# Altium schematic sheet 07_8MPLUS_PHY.SchDoc: 8MPLUS_PHY
size 420 x 297 mm; Author: Lukas Henkel; DocumentNumber: 7; SheetNumber: 7; SheetTotal: 16; DocSize: A3
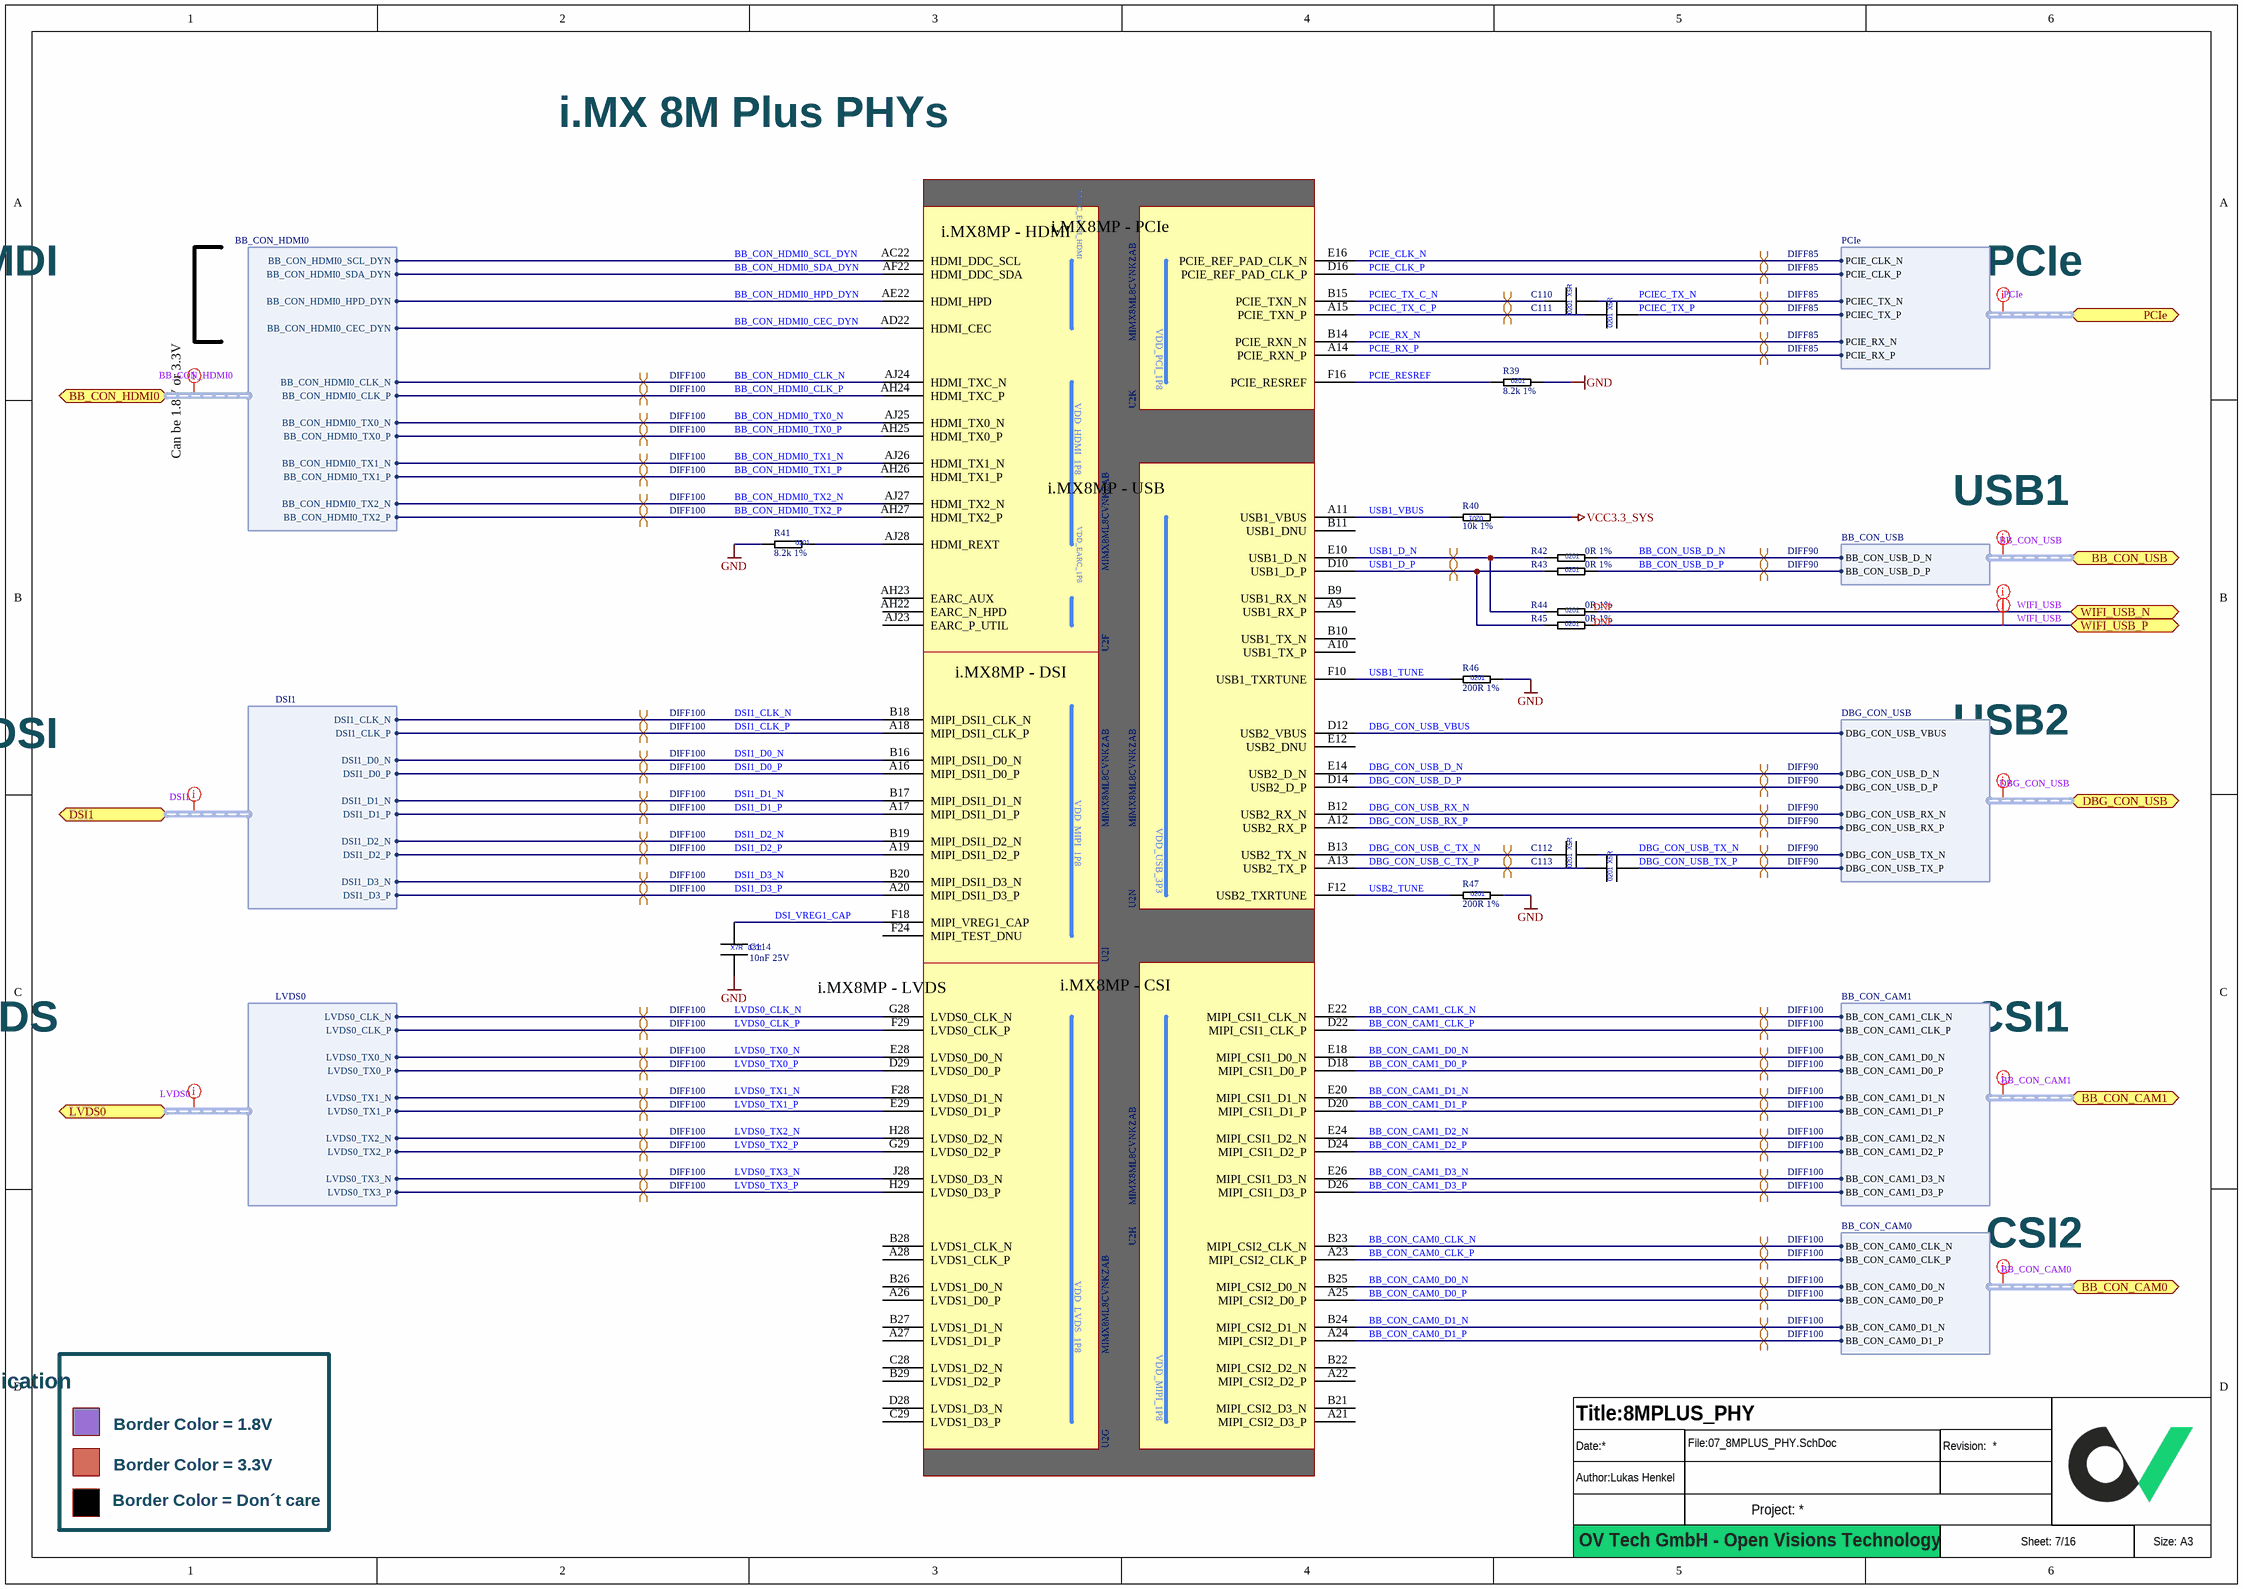
[diagram p0: 07_8MPLUS_PHY.SchDoc]

## Parts
?  (no value)  (graphical)
C110  100nF 10V  [CAPC0603X03L]  (value not drawn)
C111  100nF 10V  [CAPC0603X03L]  (value not drawn)
C112  100nF 10V  [CAPC0603X03L]  (value not drawn)
C113  100nF 10V  [CAPC0603X03L]  (value not drawn)
C114  10nF 25V  [CAPC0603X03L]
R39  8.2k 1%  [RESC0603X03L]
R40  10k 1%  [RESC0603X03L]
R41  8.2k 1%  [RESC0603X03L]
R42  0R 1%  [RESC0603X03L]
R43  0R 1%  [RESC0603X03L]
R44  0R 1%  [RESC0603X03L]
R45  0R 1%  [RESC0603X03L]
R46  200R 1%  [RESC0603X03L]
R47  200R 1%  [RESC0603X03L]
U2  MIMX8ML8CVNKZAB  [BGA548C50P29X29_1500X1500X148]  (parts F,G,H,I,K,N of 15)

## Ports
BB_CON_CAM0 (bidir, harness BB_CON_CAM0), BB_CON_CAM1 (bidir, harness BB_CON_CAM1), BB_CON_HDMI0 (bidir, harness BB_CON_HDMI0), BB_CON_USB (bidir, harness BB_CON_USB), DBG_CON_USB (bidir, harness DBG_CON_USB), DSI1 (bidir, harness DSI1), LVDS0 (bidir, harness LVDS0), PCIe (bidir, harness PCIe), WIFI_USB_N (bidir), WIFI_USB_P (bidir)

## Harnesses
BB_CON_HDMI0: BB_CON_HDMI0_SCL_DYN, BB_CON_HDMI0_SDA_DYN, BB_CON_HDMI0_HPD_DYN, BB_CON_HDMI0_CEC_DYN, BB_CON_HDMI0_CLK_N, BB_CON_HDMI0_CLK_P, BB_CON_HDMI0_TX0_N, BB_CON_HDMI0_TX0_P, BB_CON_HDMI0_TX1_N, BB_CON_HDMI0_TX1_P, BB_CON_HDMI0_TX2_N, BB_CON_HDMI0_TX2_P
BB_CON_USB: BB_CON_USB_D_N, BB_CON_USB_D_P
PCIe: PCIE_CLK_N, PCIE_CLK_P, PCIEC_TX_N, PCIE_RX_P, PCIE_RX_N, PCIEC_TX_P
BB_CON_CAM1: BB_CON_CAM1_D0_N, BB_CON_CAM1_D0_P, BB_CON_CAM1_D1_N, BB_CON_CAM1_D1_P, BB_CON_CAM1_CLK_N, BB_CON_CAM1_CLK_P, BB_CON_CAM1_D2_N, BB_CON_CAM1_D2_P, BB_CON_CAM1_D3_N, BB_CON_CAM1_D3_P
BB_CON_CAM0: BB_CON_CAM0_D0_N, BB_CON_CAM0_D0_P, BB_CON_CAM0_D1_N, BB_CON_CAM0_D1_P, BB_CON_CAM0_CLK_N, BB_CON_CAM0_CLK_P
DSI1: DSI1_CLK_N, DSI1_CLK_P, DSI1_D0_N, DSI1_D0_P, DSI1_D1_N, DSI1_D1_P, DSI1_D2_N, DSI1_D2_P, DSI1_D3_N, DSI1_D3_P
LVDS0: LVDS0_CLK_N, LVDS0_CLK_P, LVDS0_TX0_N, LVDS0_TX0_P, LVDS0_TX1_N, LVDS0_TX1_P, LVDS0_TX2_N, LVDS0_TX2_P, LVDS0_TX3_N, LVDS0_TX3_P
DBG_CON_USB: DBG_CON_USB_VBUS, DBG_CON_USB_D_N, DBG_CON_USB_D_P, DBG_CON_USB_RX_N, DBG_CON_USB_RX_P, DBG_CON_USB_TX_N, DBG_CON_USB_TX_P

## Nets
GND: C114.2 R39.2 R41.2 R46.2 R47.2
VCC3.3_SYS: R40.1
BB_CON_CAM0_CLK_N: U2.B23(MIPI_CSI2_CLK_N) ; port BB_CON_CAM0.BB_CON_CAM0_CLK_N
BB_CON_CAM0_CLK_P: U2.A23(MIPI_CSI2_CLK_P) ; port BB_CON_CAM0.BB_CON_CAM0_CLK_P
BB_CON_CAM0_D0_N: U2.B25(MIPI_CSI2_D0_N) ; port BB_CON_CAM0.BB_CON_CAM0_D0_N
BB_CON_CAM0_D0_P: U2.A25(MIPI_CSI2_D0_P) ; port BB_CON_CAM0.BB_CON_CAM0_D0_P
BB_CON_CAM0_D1_N: U2.B24(MIPI_CSI2_D1_N) ; port BB_CON_CAM0.BB_CON_CAM0_D1_N
BB_CON_CAM0_D1_P: U2.A24(MIPI_CSI2_D1_P) ; port BB_CON_CAM0.BB_CON_CAM0_D1_P
BB_CON_CAM1_CLK_N: U2.E22(MIPI_CSI1_CLK_N) ; port BB_CON_CAM1.BB_CON_CAM1_CLK_N
BB_CON_CAM1_CLK_P: U2.D22(MIPI_CSI1_CLK_P) ; port BB_CON_CAM1.BB_CON_CAM1_CLK_P
BB_CON_CAM1_D0_N: U2.E18(MIPI_CSI1_D0_N) ; port BB_CON_CAM1.BB_CON_CAM1_D0_N
BB_CON_CAM1_D0_P: U2.D18(MIPI_CSI1_D0_P) ; port BB_CON_CAM1.BB_CON_CAM1_D0_P
BB_CON_CAM1_D1_N: U2.E20(MIPI_CSI1_D1_N) ; port BB_CON_CAM1.BB_CON_CAM1_D1_N
BB_CON_CAM1_D1_P: U2.D20(MIPI_CSI1_D1_P) ; port BB_CON_CAM1.BB_CON_CAM1_D1_P
BB_CON_CAM1_D2_N: U2.E24(MIPI_CSI1_D2_N) ; port BB_CON_CAM1.BB_CON_CAM1_D2_N
BB_CON_CAM1_D2_P: U2.D24(MIPI_CSI1_D2_P) ; port BB_CON_CAM1.BB_CON_CAM1_D2_P
BB_CON_CAM1_D3_N: U2.E26(MIPI_CSI1_D3_N) ; port BB_CON_CAM1.BB_CON_CAM1_D3_N
BB_CON_CAM1_D3_P: U2.D26(MIPI_CSI1_D3_P) ; port BB_CON_CAM1.BB_CON_CAM1_D3_P
BB_CON_HDMI0_CEC_DYN: U2.AD22(HDMI_CEC) ; port BB_CON_HDMI0.BB_CON_HDMI0_CEC_DYN
BB_CON_HDMI0_CLK_N: U2.AJ24(HDMI_TXC_N) ; port BB_CON_HDMI0.BB_CON_HDMI0_CLK_N
BB_CON_HDMI0_CLK_P: U2.AH24(HDMI_TXC_P) ; port BB_CON_HDMI0.BB_CON_HDMI0_CLK_P
BB_CON_HDMI0_HPD_DYN: U2.AE22(HDMI_HPD) ; port BB_CON_HDMI0.BB_CON_HDMI0_HPD_DYN
BB_CON_HDMI0_SCL_DYN: U2.AC22(HDMI_DDC_SCL) ; port BB_CON_HDMI0.BB_CON_HDMI0_SCL_DYN
BB_CON_HDMI0_SDA_DYN: U2.AF22(HDMI_DDC_SDA) ; port BB_CON_HDMI0.BB_CON_HDMI0_SDA_DYN
BB_CON_HDMI0_TX0_N: U2.AJ25(HDMI_TX0_N) ; port BB_CON_HDMI0.BB_CON_HDMI0_TX0_N
BB_CON_HDMI0_TX0_P: U2.AH25(HDMI_TX0_P) ; port BB_CON_HDMI0.BB_CON_HDMI0_TX0_P
BB_CON_HDMI0_TX1_N: U2.AJ26(HDMI_TX1_N) ; port BB_CON_HDMI0.BB_CON_HDMI0_TX1_N
BB_CON_HDMI0_TX1_P: U2.AH26(HDMI_TX1_P) ; port BB_CON_HDMI0.BB_CON_HDMI0_TX1_P
BB_CON_HDMI0_TX2_N: U2.AJ27(HDMI_TX2_N) ; port BB_CON_HDMI0.BB_CON_HDMI0_TX2_N
BB_CON_HDMI0_TX2_P: U2.AH27(HDMI_TX2_P) ; port BB_CON_HDMI0.BB_CON_HDMI0_TX2_P
BB_CON_USB_D_N: R42.2 ; port BB_CON_USB.BB_CON_USB_D_N
BB_CON_USB_D_P: R43.2 ; port BB_CON_USB.BB_CON_USB_D_P
DBG_CON_USB_C_TX_N: C112.1 U2.B13(USB2_TX_N)
DBG_CON_USB_C_TX_P: C113.1 U2.A13(USB2_TX_P)
DBG_CON_USB_D_N: U2.E14(USB2_D_N) ; port DBG_CON_USB.DBG_CON_USB_D_N
DBG_CON_USB_D_P: U2.D14(USB2_D_P) ; port DBG_CON_USB.DBG_CON_USB_D_P
DBG_CON_USB_RX_N: U2.B12(USB2_RX_N) ; port DBG_CON_USB.DBG_CON_USB_RX_N
DBG_CON_USB_RX_P: U2.A12(USB2_RX_P) ; port DBG_CON_USB.DBG_CON_USB_RX_P
DBG_CON_USB_TX_N: C112.2 ; port DBG_CON_USB.DBG_CON_USB_TX_N
DBG_CON_USB_TX_P: C113.2 ; port DBG_CON_USB.DBG_CON_USB_TX_P
DBG_CON_USB_VBUS: U2.D12(USB2_VBUS) ; port DBG_CON_USB.DBG_CON_USB_VBUS
DSI1_CLK_N: U2.B18(MIPI_DSI1_CLK_N) ; port DSI1.DSI1_CLK_N
DSI1_CLK_P: U2.A18(MIPI_DSI1_CLK_P) ; port DSI1.DSI1_CLK_P
DSI1_D0_N: U2.B16(MIPI_DSI1_D0_N) ; port DSI1.DSI1_D0_N
DSI1_D0_P: U2.A16(MIPI_DSI1_D0_P) ; port DSI1.DSI1_D0_P
DSI1_D1_N: U2.B17(MIPI_DSI1_D1_N) ; port DSI1.DSI1_D1_N
DSI1_D1_P: U2.A17(MIPI_DSI1_D1_P) ; port DSI1.DSI1_D1_P
DSI1_D2_N: U2.B19(MIPI_DSI1_D2_N) ; port DSI1.DSI1_D2_N
DSI1_D2_P: U2.A19(MIPI_DSI1_D2_P) ; port DSI1.DSI1_D2_P
DSI1_D3_N: U2.B20(MIPI_DSI1_D3_N) ; port DSI1.DSI1_D3_N
DSI1_D3_P: U2.A20(MIPI_DSI1_D3_P) ; port DSI1.DSI1_D3_P
DSI_VREG1_CAP: C114.1 U2.F18(MIPI_VREG1_CAP)
LVDS0_CLK_N: U2.G28(LVDS0_CLK_N) ; port LVDS0.LVDS0_CLK_N
LVDS0_CLK_P: U2.F29(LVDS0_CLK_P) ; port LVDS0.LVDS0_CLK_P
LVDS0_TX0_N: U2.E28(LVDS0_D0_N) ; port LVDS0.LVDS0_TX0_N
LVDS0_TX0_P: U2.D29(LVDS0_D0_P) ; port LVDS0.LVDS0_TX0_P
LVDS0_TX1_N: U2.F28(LVDS0_D1_N) ; port LVDS0.LVDS0_TX1_N
LVDS0_TX1_P: U2.E29(LVDS0_D1_P) ; port LVDS0.LVDS0_TX1_P
LVDS0_TX2_N: U2.H28(LVDS0_D2_N) ; port LVDS0.LVDS0_TX2_N
LVDS0_TX2_P: U2.G29(LVDS0_D2_P) ; port LVDS0.LVDS0_TX2_P
LVDS0_TX3_N: U2.J28(LVDS0_D3_N) ; port LVDS0.LVDS0_TX3_N
LVDS0_TX3_P: U2.H29(LVDS0_D3_P) ; port LVDS0.LVDS0_TX3_P
PCIE_CLK_N: U2.E16(PCIE_REF_PAD_CLK_N) ; port PCIe.PCIE_CLK_N
PCIE_CLK_P: U2.D16(PCIE_REF_PAD_CLK_P) ; port PCIe.PCIE_CLK_P
PCIE_RESREF: R39.1 U2.F16(PCIE_RESREF)
PCIE_RX_N: U2.B14(PCIE_RXN_N) ; port PCIe.PCIE_RX_N
PCIE_RX_P: U2.A14(PCIE_RXN_P) ; port PCIe.PCIE_RX_P
PCIEC_TX_C_N: C110.1 U2.B15(PCIE_TXN_N)
PCIEC_TX_C_P: C111.1 U2.A15(PCIE_TXN_P)
PCIEC_TX_N: C110.2 ; port PCIe.PCIEC_TX_N
PCIEC_TX_P: C111.2 ; port PCIe.PCIEC_TX_P
USB1_D_N: R42.1 R44.1 U2.E10(USB1_D_N)
USB1_D_P: R43.1 R45.1 U2.D10(USB1_D_P)
USB1_TUNE: R46.1 U2.F10(USB1_TXRTUNE)
USB1_VBUS: R40.2 U2.A11(USB1_VBUS)
USB2_TUNE: R47.1 U2.F12(USB2_TXRTUNE)
WIFI_USB_N: R44.2 ; port WIFI_USB_N
WIFI_USB_P: R45.2 ; port WIFI_USB_P
NetR41_1: R41.1 U2.AJ28(HDMI_REXT)

Not connected (* = marked no-connect by the designer): U2 A9(USB1_RX_P) A10(USB1_TX_P) A21(MIPI_CSI2_D3_P) A22(MIPI_CSI2_D2_P) A26(LVDS1_D0_P) A27(LVDS1_D1_P) A28(LVDS1_CLK_P) AH22(EARC_N_HPD) AH23(EARC_AUX) AJ23(EARC_P_UTIL) B9(USB1_RX_N) B10(USB1_TX_N) B11(USB1_DNU) B21(MIPI_CSI2_D3_N) B22(MIPI_CSI2_D2_N) B26(LVDS1_D0_N) B27(LVDS1_D1_N) B28(LVDS1_CLK_N) B29(LVDS1_D2_P) C28(LVDS1_D2_N) C29(LVDS1_D3_P) D28(LVDS1_D3_N) E12(USB2_DNU) F24(MIPI_TEST_DNU)

## Layout directives
net class BB_CON_HDMI0: (no net found under the mark)
differential pair; differential pair class DIFF100: BB_CON_CAM0_CLK_N, BB_CON_CAM0_CLK_P, BB_CON_CAM0_D0_N, BB_CON_CAM0_D0_P, BB_CON_CAM0_D1_N, BB_CON_CAM0_D1_P, BB_CON_CAM1_CLK_N, BB_CON_CAM1_CLK_P, BB_CON_CAM1_D0_N, BB_CON_CAM1_D0_P, BB_CON_CAM1_D1_N, BB_CON_CAM1_D1_P, BB_CON_CAM1_D2_N, BB_CON_CAM1_D2_P, BB_CON_CAM1_D3_N, BB_CON_CAM1_D3_P, BB_CON_HDMI0_CLK_N, BB_CON_HDMI0_CLK_P, BB_CON_HDMI0_TX0_N, BB_CON_HDMI0_TX0_P, BB_CON_HDMI0_TX1_N, BB_CON_HDMI0_TX1_P, BB_CON_HDMI0_TX2_N, BB_CON_HDMI0_TX2_P, DSI1_CLK_N, DSI1_CLK_P, DSI1_D0_N, DSI1_D0_P, DSI1_D1_N, DSI1_D1_P, DSI1_D2_N, DSI1_D2_P, DSI1_D3_N, DSI1_D3_P, LVDS0_CLK_N, LVDS0_CLK_P, LVDS0_TX0_N, LVDS0_TX0_P, LVDS0_TX1_N, LVDS0_TX1_P, LVDS0_TX2_N, LVDS0_TX2_P, LVDS0_TX3_N, LVDS0_TX3_P
net class BB_CON_USB: (no net found under the mark)
differential pair; differential pair class DIFF90: BB_CON_USB_D_N, BB_CON_USB_D_P, DBG_CON_USB_C_TX_N, DBG_CON_USB_C_TX_P, DBG_CON_USB_D_N, DBG_CON_USB_D_P, DBG_CON_USB_RX_N, DBG_CON_USB_RX_P, DBG_CON_USB_TX_N, DBG_CON_USB_TX_P, USB1_D_N, USB1_D_P
net class PCIe: (no net found under the mark)
differential pair; differential pair class DIFF85: PCIE_CLK_N, PCIE_CLK_P, PCIE_RX_N, PCIE_RX_P, PCIEC_TX_C_N, PCIEC_TX_C_P, PCIEC_TX_N, PCIEC_TX_P
net class BB_CON_CAM1: (no net found under the mark)
net class BB_CON_CAM0: (no net found under the mark)
net class DSI1: (no net found under the mark)
net class LVDS0: (no net found under the mark)
net class DBG_CON_USB: (no net found under the mark)
net class WIFI_USB: WIFI_USB_N, WIFI_USB_P

## Notes on the sheet
- i.MX 8M Plus PHYs
- HMDI
- PCIe
- Can be 1.8V or 3.3V
- USB1
- DNP
- DSI
- USB2
- LVDS
- CSI1
- CSI2
- Signal Level Indication
- Border Color = 1.8V
- Border Color = 3.3V
- Border Color = Don´t care
- OV Tech GmbH - Open Visions Technology
- (in symbol CAP_0201_10nF_25V) X7R; 0201
- (in symbol CAP_0201_100nF_10V) X5R; 0201
- (in symbol RES_0201_0R_1%) 0201
- (in symbol RES_0201_8.2k_1%) 0201
- (in symbol RES_0201_10k_1%) 0201
- (in symbol RES_0201_200R_1%) 0201
- (in symbol SoC_i.MX 8M Plus_Quad, part F) i.MX8MP - HDMI
- (in symbol SoC_i.MX 8M Plus_Quad, part G) i.MX8MP - LVDS
- (in symbol SoC_i.MX 8M Plus_Quad, part H) i.MX8MP - CSI
- (in symbol SoC_i.MX 8M Plus_Quad, part I) i.MX8MP - DSI
- (in symbol SoC_i.MX 8M Plus_Quad, part K) i.MX8MP - PCIe
- (in symbol SoC_i.MX 8M Plus_Quad, part N) i.MX8MP - USB

## Library data of the parts
? = Titleblock_01_OpenSource
C110-C113 = CAP_0201_100nF_10V: Multilayer Ceramic Capacitors MLCC - SMD/SMT 0201 10VDC; Manufacturer 1: Murata Electronics; Manufacturer 1 Prt. Nr.: GRT033R61A104KE01J; Manufacturer 2 Prt. Nr.: CL03A104MP3NNNC; Manufacturer 2: Samsung Electro-Mechanics
C114 = CAP_0201_10nF_25V: Multilayer Ceramic Capacitors MLCC - SMD/SMT 0201 25VDC; Manufacturer 1: Murata Electronics; Manufacturer 1 Prt. Nr.: GRM033C81E103KE14D; Manufacturer 2 Prt. Nr.: 02013C103KAT2A; Manufacturer 2: AVX
R39 R41 = RES_0201_8.2k_1%: Thick Film Resistors - SMD 8.2K OHM 1%; Manufacturer 1: Yageo; Manufacturer 1 Prt. Nr.: RC0201FR-078K2L; Manufacturer 2 Prt. Nr.: CRCW02018K20FNED; Manufacturer 2: Vishay / Dale
R40 = RES_0201_10k_1%: Thick Film Resistors - SMD 10K OHM 1%; Manufacturer 1: Yageo; Manufacturer 1 Prt. Nr.: RC0201FR-0710KL; Manufacturer 2 Prt. Nr.: CRCW020110K0FNED; Manufacturer 2: Vishay / Dale
R42-R45 = RES_0201_0R_1%: Thick Film Resistors - SMD 0R OHM 1%; Manufacturer 1: Yageo; Manufacturer 1 Prt. Nr.: RC0201FR-070RL; Manufacturer 2 Prt. Nr.: CRCW02010000Z0ED; Manufacturer 2: Vishay / Dale
R46 R47 = RES_0201_200R_1%: Thick Film Resistors - SMD 200 OHM 1%; Manufacturer 1: Yageo; Manufacturer 1 Prt. Nr.: RC0201FR-07200RL; Manufacturer 2 Prt. Nr.: CRCW0201200RFNED; Manufacturer 2: Vishay / Dale
U2 = SoC_i.MX 8M Plus_Quad: i.MX 8M Plus Applications Processor  for Industrial Products; Manufacturer 1: NXP Semiconductor; Manufacturer 1 Prt. Nr.: MIMX8ML8CVNKZAB